# Altium schematic sheet llrf_afe_rio_channel.SchDoc: =GlobalProjectName
size 209 x 297 mm; SheetNumber: 4; SheetTotal: 17; PageSetup: Record=PageOptions|CenterHorizontal=True|CenterVertical=True|PrintScale=1.00|XCorrection=1.00|YCorrection=1.00|PrintKind=1|BorderSize=5000000|LeftOffset=0|BottomOffset=0|Orientation=2|PaperLength=1000|PaperWidth=1000|Scale=100|PaperSource=15|PrintQuality=1200|MediaType=1|DitherType=10|PaperKind=A3|PrintScaleMode=1; Weight: -; ScaleFactor: -
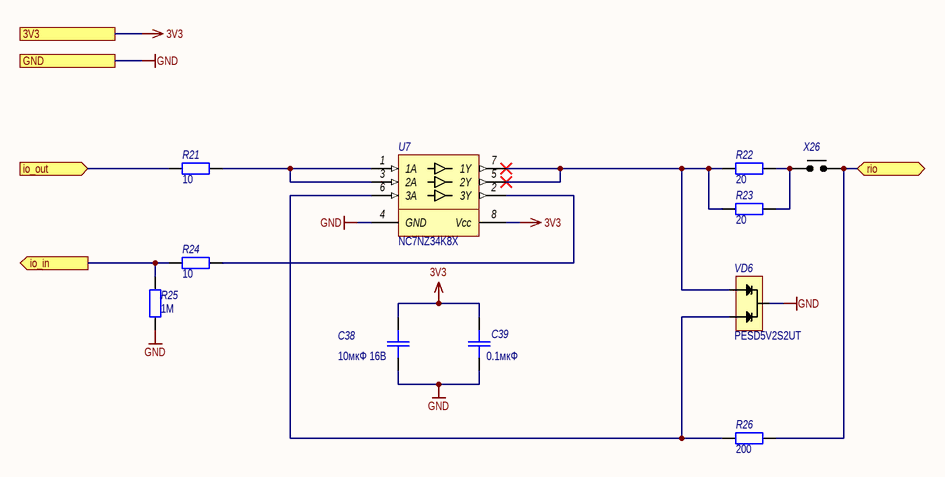
[diagram p0: llrf_afe_rio_channel.SchDoc]

## Parts
C38  10мкФ 16В  [SMD_C0603]
C39  0.1мкФ  [SMD_C0402]
R21  10  [SMD_0603]
R22  20  [SMD_1206]
R23  20  [SMD_1206]
R24  10  [SMD_0603]
R25  1M  [SMD_0603]
R26  200  [SMD_0603]
U7  Наименование: NC7NZ34K8X  [US-8]  (hidden comment: NC7NZ34)
VD6  Наименование: PESD5V2S2UT  [SOT-23]  (hidden comment: PESDxS2UT)
X26  Jumper 2  [PLS-2]  (value not drawn)

## Ports
3V3, GND, io_in (out), io_out (in), rio (bidir)

## Nets
3V3: C38.2 C39.2 U7.8(Vcc) ; port 3V3
GND: C38.1 C39.1 R25.1 U7.4(GND) VD6.3(C3) ; port GND
io_in: R24.1 R25.2 ; port io_in
io_out: R21.1 ; port io_out
rio: R26.2 X26.2 ; port rio
NetR21_2: R21.2 U7.1(1A) U7.3(2A)
NetR22_1: R22.1 R23.1 U7.5(2Y) U7.7(1Y) VD6.1(C1)
NetR22_2: R22.2 R23.2 X26.1
NetR24_2: R24.2 U7.2(3Y)
NetR26_1: R26.1 U7.6(3A) VD6.2(C2)

## Notes on the sheet
- Подп. и дата
- Инв. № дубл.
- Взам. инв. №
- Инв. № подл.
- Изм.
- Лист
- № докум.
- Подп.
- Дата
- Форма 2а ГОСТ 2.104-2006
- Копировал
- Формат А4

## Library data of the parts
C38 = Capacitor: Назначение: SMD-конденсатор; Наименование: GRM188C81C106MA73; Потребление, Вт: 0; Value: 10мкФ 16В
C39 = Capacitor: Назначение: SMD-конденсатор; Наименование: Конденсатор; Потребление, Вт: 0; Value: 0.1мкФ
R21-R26 = Resistor: Наименование: Резистор; Назначение: SMD-резистор; Потребление, Вт: 0,001
  R21 R24: Value: 10
  R22 R23: Value: 20
  R25: Value: 1M
  R26: Value: 200
U7 = NC7NZ34: TinyLogic UHS Triple Buffer; Потребление, Вт: 0.01; Назначение: TinyLogic UHS Triple Buffer; ComponentLink1Description: DataSheet; ComponentLink1URL: https://www.onsemi.com/pdf/datasheet/nc7nz34-d.pdf; Supplier 1: Digi-Key; Supplier Part Number 1: NC7NZ34K8XCT-ND
VD6 = PESDxS2UT: Double ESD protection diodes; Потребление, Вт: 0; Назначение: Double ESD protection diodes; ComponentLink1Description: DataSheet; ComponentLink1URL: https://assets.nexperia.com/documents/data-sheet/PESDXS2UT_SERIES.pdf
X26 = Jumper 2: Jumper, 2-Pin, Dual row; Потребление, Вт: 0,0; Наименование: Jumper 2-pin; Назначение: Jumper, 2-Pin, Dual row